# EAGLE design BEL (EAGLE 5.11)
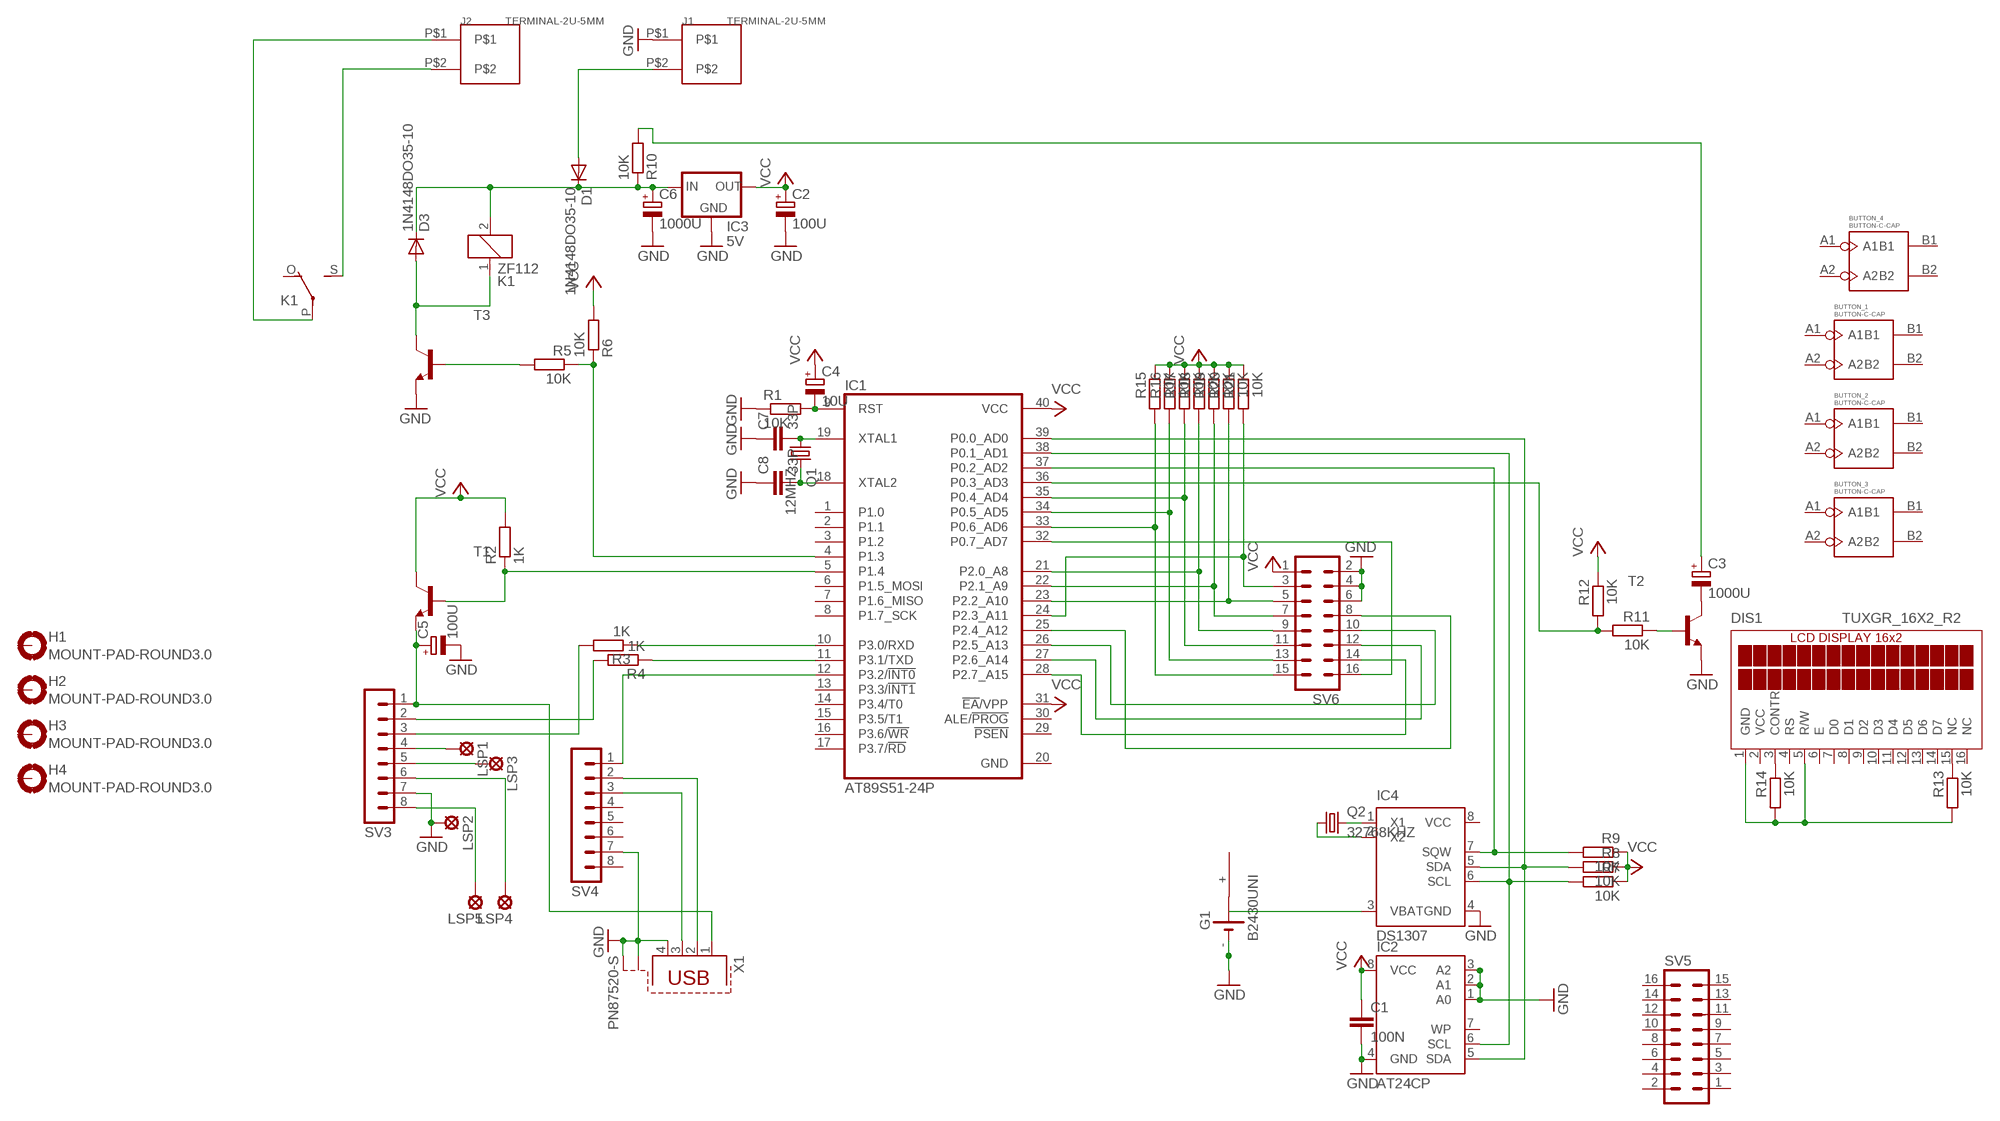
[diagram p0: schematic, sheet 1]

## Parts
BUTTON_1  BUTTON-C-CAP  [BUTTON_BIG_4PIN]
BUTTON_2  BUTTON-C-CAP  [BUTTON_BIG_4PIN]
BUTTON_3  BUTTON-C-CAP  [BUTTON_BIG_4PIN]
BUTTON_4  BUTTON-C-CAP  [BUTTON_BIG_4PIN]
C1  100N  C-EU075-032X103  [C075-032X103]
C2  100U  CPOL-EUE2.5-5  [E2,5-5]
C3  1000U  CPOL-EUE7.5-18  [E7,5-18]
C4  10U  CPOL-EUE2.5-5  [E2,5-5]
C5  100U  CPOL-EUE2.5-5  [E2,5-5]
C6  1000U  CPOL-EUE5-8.5  [E5-8,5]
C7  33P  C-EU025-025X050  [C025-025X050]
C8  33P  C-EU025-025X050  [C025-025X050]
D1  1N4148DO35-10  [DO35-10]
D3  1N4148DO35-10  [DO35-10]
DIS1  TUXGR_16X2_R2  [TUXGR_16X2_R2]
G1  B2430UNI  [B2430UNI]
H1  MOUNT-PAD-ROUND3.0  [3,0-PAD]
H2  MOUNT-PAD-ROUND3.0  [3,0-PAD]
H3  MOUNT-PAD-ROUND3.0  [3,0-PAD]
H4  MOUNT-PAD-ROUND3.0  [3,0-PAD]
IC1  AT89S51-24P  [DIL40]
IC2  AT24CP  [DIL08]
IC3  5V  78XXS  [78XXS]
IC4  DS1307  [DIP-8]
J1  TERMINAL-2U-5MM  [TERMINAL-2U-5MM]
J2  TERMINAL-2U-5MM  [TERMINAL-2U-5MM]
K1  ZF112  [ZF112]
LSP1  SE11  [SE11]
LSP2  SE11  [SE11]
LSP3  SE11  [SE11]
LSP4  SE11  [SE11]
LSP5  SE11  [SE11]
Q1  12MHZ  CRYSTALHC49S  [HC49/S]
Q2  32768KHZ  CRYSTALTC38H  [TC38H]
R1  10K  R-EU_0207/10  [0207/10]
R2  1K  R-EU_0207/10  [0207/10]
R3  1K  R-EU_0207/10  [0207/10]
R4  1K  R-EU_0207/10  [0207/10]
R5  10K  R-EU_0207/10  [0207/10]
R6  10K  R-EU_0207/10  [0207/10]
R7  10K  R-EU_0207/10  [0207/10]
R8  10K  R-EU_0207/10  [0207/10]
R9  10K  R-EU_0207/10  [0207/10]
R10  10K  R-EU_0207/10  [0207/10]
R11  10K  R-EU_0207/10  [0207/10]
R12  10K  R-EU_0207/10  [0207/10]
R13  10K  R-EU_0207/10  [0207/10]
R14  10K  R-EU_0207/10  [0207/10]
R15  10K  R-EU_0207/10  [0207/10]
R16  10K  R-EU_0207/10  [0207/10]
R17  10K  R-EU_0207/10  [0207/10]
R18  10K  R-EU_0207/10  [0207/10]
R19  10K  R-EU_0207/10  [0207/10]
R20  10K  R-EU_0207/10  [0207/10]
R21  10K  R-EU_0207/10  [0207/10]
SV3  MA08-1  [MA08-1]
SV4  MA08-1  [MA08-1]
SV5  ML16  [ML16]
SV6  ML16  [ML16]
T1  BC547-NPN-TO92-CBE  [TO92-CBE]
T2  BC547-NPN-TO92-CBE  [TO92-CBE]
T3  BC547-NPN-TO92-CBE  [TO92-CBE]
X1  PN87520-S  [PN87520-S]

## Nets
GND: C1.2 C2.- C5.- C6.- C7.1 C8.1 G1.- G1.-@1(-) IC2.1(A0) IC2.2(A1) IC2.3(A2) IC2.4(GND) IC3.GND IC4.4(GND) J1.P$1 LSP2.MP R1.1 SV3.7 SV4.7 SV6.2 SV6.4 SV6.6 T2.E T3.E X1.4 X1.S1 X1.S2
N$1: C8.2 IC1.18(XTAL2) Q1.2
N$2: C7.2 IC1.19(XTAL1) Q1.1
N$3: C4.- IC1.9(RST) R1.2
N$4: C3.+ R10.2
N$5: D3.A K1.1 T3.C
N$6: C5.+ SV3.1 T1.E X1.1
N$7: IC1.5(P1.4) R2.1 T1.B
N$8: IC4.2(X2) Q2.1
N$9: R4.2 SV3.2
N$10: R3.2 SV3.3
N$11: IC1.11(P3.1/TXD) R4.1
N$12: IC1.10(P3.0/RXD) R3.1
N$13: IC1.12(P3.2/!INT0) SV4.1
N$14: IC4.1(X1) Q2.2
N$15: IC1.38(P0.1_AD1) IC2.6(SCL) IC4.6(SCL) R7.2
N$16: SV4.2 X1.2
N$17: SV4.3 X1.3
N$18: LSP4.MP SV3.6
N$19: G1.+@4(+) IC4.3(VBAT)
N$20: R5.2 T3.B
N$21: IC1.4(P1.3) R5.1 R6.1
N$22: D1.A J1.P$2
N$23: J2.P$2 K1.S(2:S)
N$24: J2.P$1 K1.P(2:P)
N$25: IC1.37(P0.2_AD2) IC4.7(SQW) R9.2
N$27: C3.- T2.C
N$28: IC1.39(P0.0_AD0) IC2.5(SDA) IC4.5(SDA) R8.2
N$29: R11.1 T2.B
N$30: C6.+ D1.C D3.C IC3.IN K1.2 R10.1
N$31: IC1.36(P0.3_AD3) R11.2 R12.2
N$32: LSP5.MP SV3.8
N$33: LSP1.MP SV3.4
N$34: LSP3.MP SV3.5
N$35: DIS1.15(NC) R13.1
N$36: DIS1.3(CONTR) R14.1
N$37: DIS1.1(GND) DIS1.5(R/W) R13.2 R14.2
N$38: IC1.24(P2.3_A11) R21.2 SV6.3
N$39: IC1.23(P2.2_A10) R20.2 SV6.5
N$40: IC1.22(P2.1_A9) R19.2 SV6.7
N$41: IC1.21(P2.0_A8) R18.2 SV6.9
N$42: IC1.35(P0.4_AD4) R17.2 SV6.11
N$43: IC1.34(P0.5_AD5) R16.2 SV6.13
N$44: IC1.33(P0.6_AD6) R15.2 SV6.15
N$45: IC1.32(P0.7_AD7) SV6.16
N$46: IC1.28(P2.7_A15) SV6.14
N$47: IC1.27(P2.6_A14) SV6.12
N$48: IC1.26(P2.5_A13) SV6.10
N$49: IC1.25(P2.4_A12) SV6.8
VCC: C1.1 C2.+ C4.+ IC1.31(!EA!/VPP) IC1.40(VCC) IC2.8(VCC) IC3.OUT R2.2 R6.2 R7.1 R8.1 R9.1 R12.1 R15.1 R16.1 R17.1 R18.1 R19.1 R20.1 R21.1 SV6.1 T1.C
Unconnected: BUTTON_1.A1 BUTTON_1.A2 BUTTON_1.B1 BUTTON_1.B2 BUTTON_2.A1 BUTTON_2.A2 BUTTON_2.B1 BUTTON_2.B2 BUTTON_3.A1 BUTTON_3.A2 BUTTON_3.B1 BUTTON_3.B2 BUTTON_4.A1 BUTTON_4.A2 BUTTON_4.B1 BUTTON_4.B2 DIS1.4(RS) DIS1.6(E) DIS1.7(D0) DIS1.8(D1) DIS1.9(D2) DIS1.10(D3) DIS1.11(D4) DIS1.12(D5) DIS1.13(D6) DIS1.14(D7) DIS1.16(NC) G1.+ G1.+@1(+) G1.+@2(+) G1.+@3(+) H1.B3,0(MOUNT) H2.B3,0(MOUNT) H3.B3,0(MOUNT) H4.B3,0(MOUNT) IC1.1(P1.0) IC1.2(P1.1) IC1.3(P1.2) IC1.6(P1.5_MOSI) IC1.7(P1.6_MISO) IC1.8(P1.7_SCK) IC1.13(P3.3/!INT1) IC1.14(P3.4/T0) IC1.15(P3.5/T1) IC1.16(P3.6/!WR) IC1.17(P3.7/!RD) IC1.29(!PSEN) IC1.30(ALE/!PROG) IC2.7(WP) K1.O(2:O) SV4.4 SV4.5 SV4.6 SV4.8 SV5.1 SV5.2 SV5.3 SV5.4 SV5.5 SV5.6 SV5.7 SV5.8 SV5.9 SV5.10 SV5.11 SV5.12 SV5.13 SV5.14 SV5.15 SV5.16

## Power pins joined to a net without a drawn wire
GND: IC1.20(GND)
VCC: DIS1.2(VCC) IC4.8(VCC)

## Library data of the parts
BUTTON_1-BUTTON_4 = Itead_BP_110825.lbr:BUTTON-C-CAP: BAS004
C1 C7 C8 = resistor:C-EU: CAPACITOR, European symbol
C2-C6 = resistor:CPOL-EU: POLARIZED CAPACITOR, European symbol
D1 D3 = diode:1N4148: DIODE high speed (Philips)
DIS1 = display-lcd:TUXGR_16X2_R2: Tuxgraphics LCD display 16x2 characters reflective, without background light Source: tuxgr_12x2_r2.pdf; OC_FARNELL: unknown; OC_NEWARK: unknown
G1 = battery:B2430UNI: LI BATTERY
H1-H4 = holes:MOUNT-PAD-ROUND: MOUNTING PAD, round
IC1 = atmel:AT89S51-*: 8-bit Microcontroller with 4K BytesIn-System Programmable Flash Source: http://www.atmel.com/dyn/resources/prod_documents/doc2487.pdf; MPN: AT89S51-24PU; OC_FARNELL: 1095739; OC_NEWARK: 96K6578
IC2 = atmel:AT24C*: 2-wire serial EEPROM; MPN: AT24C1024BW-SH-B; OC_FARNELL: 1362646; OC_NEWARK: 03P2044
IC3 = v-reg:78XXS: VOLTAGE REGULATOR
IC4 = DS1307:DS1307: DS1307 - 64×8, Serial, I2C Real Time Clock
J1 J2 = Itead_BP_110825.lbr:TERMINAL-2U-5MM: CON001
K1 = relay:ZF112: RELAY 1 x switch; OC_FARNELL: unknown; OC_NEWARK: unknown
LSP1-LSP5 = solpad:SE11: SOLDER PAD RTM, drill 1,1mm, distributor Buerklin, 07F810
Q1 = crystal:CRYSTAL: CRYSTAL; OC_FARNELL: 1667008; OC_NEWARK: unknown
Q2 = crystal:CRYSTAL: CRYSTAL; OC_FARNELL: unknown; OC_NEWARK: unknown
R1-R21 = resistor:R-EU_: RESISTOR, European symbol
SV3 SV4 = con-lstb:MA08-1: PIN HEADER; OC_FARNELL: unknown; OC_NEWARK: unknown
SV5 SV6 = con-harting-ml:ML16: HARTING; OC_FARNELL: unknown; OC_NEWARK: unknown
T1-T3 = transistor:*-NPN-: NPN Transistror BF959 corrected 2008.03.06
X1 = con-berg:PN87520-S; OC_FARNELL: unknown; OC_NEWARK: unknown

## Board
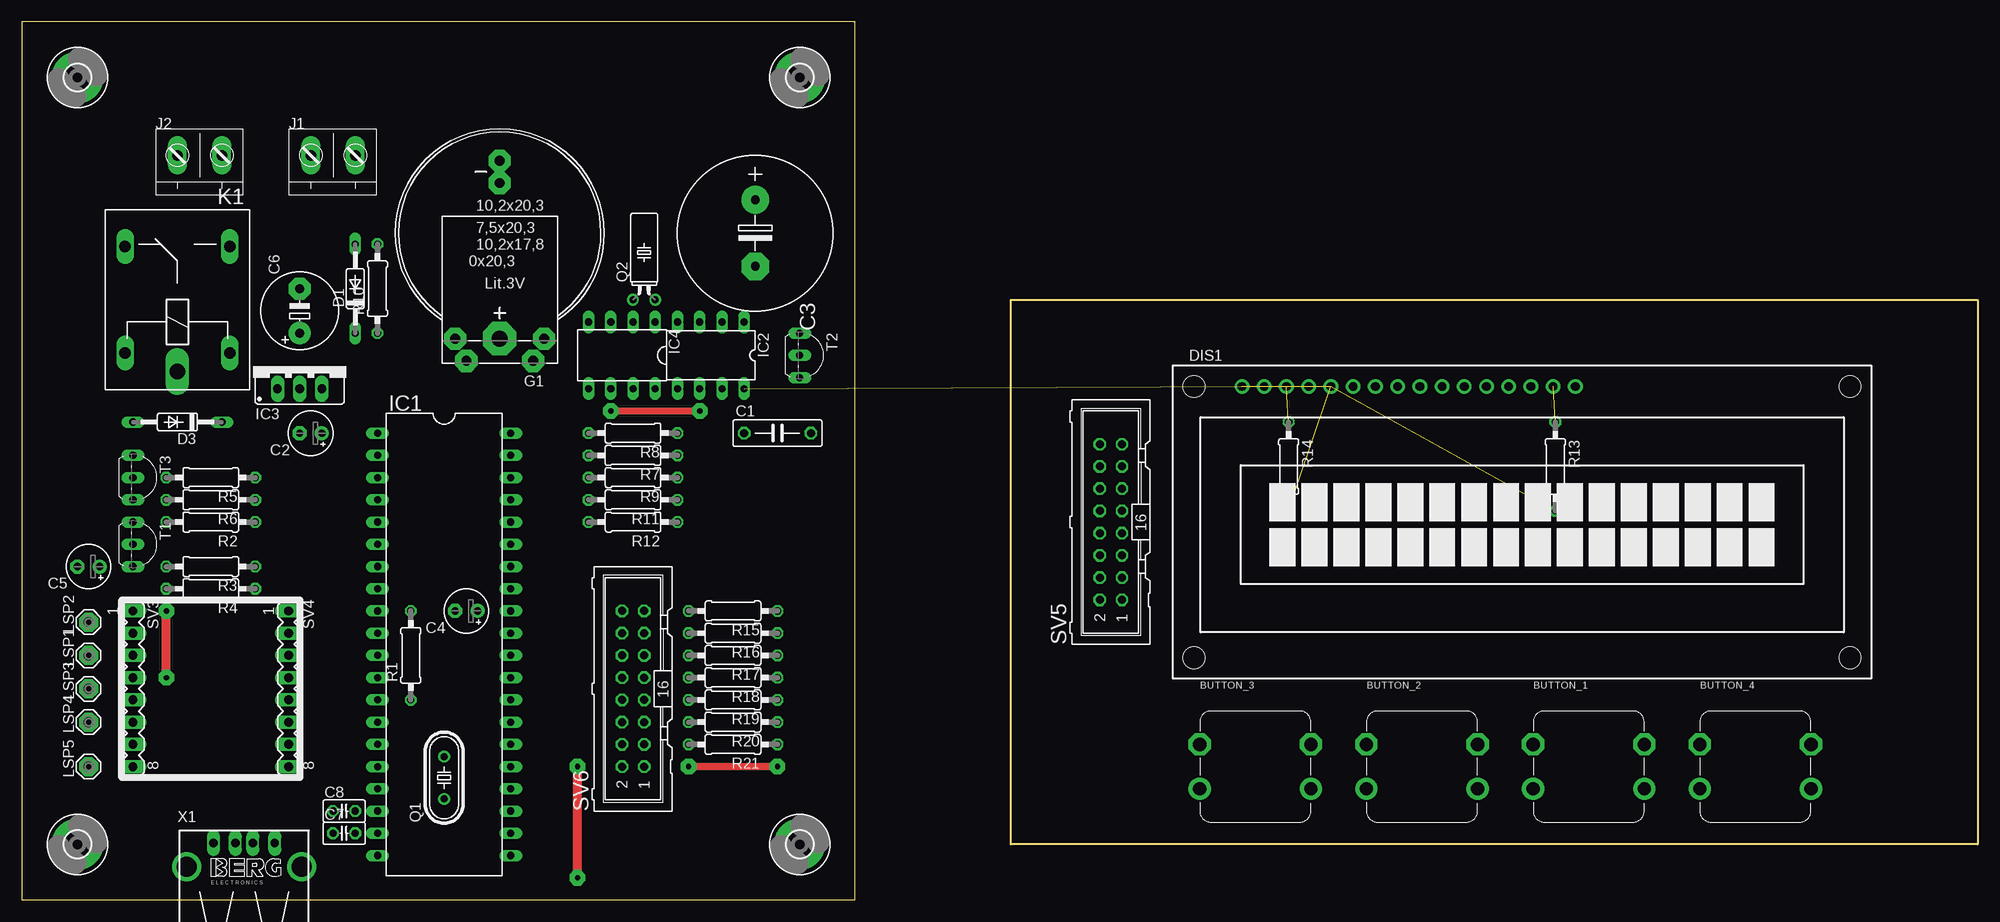
[diagram p1: board, top side]
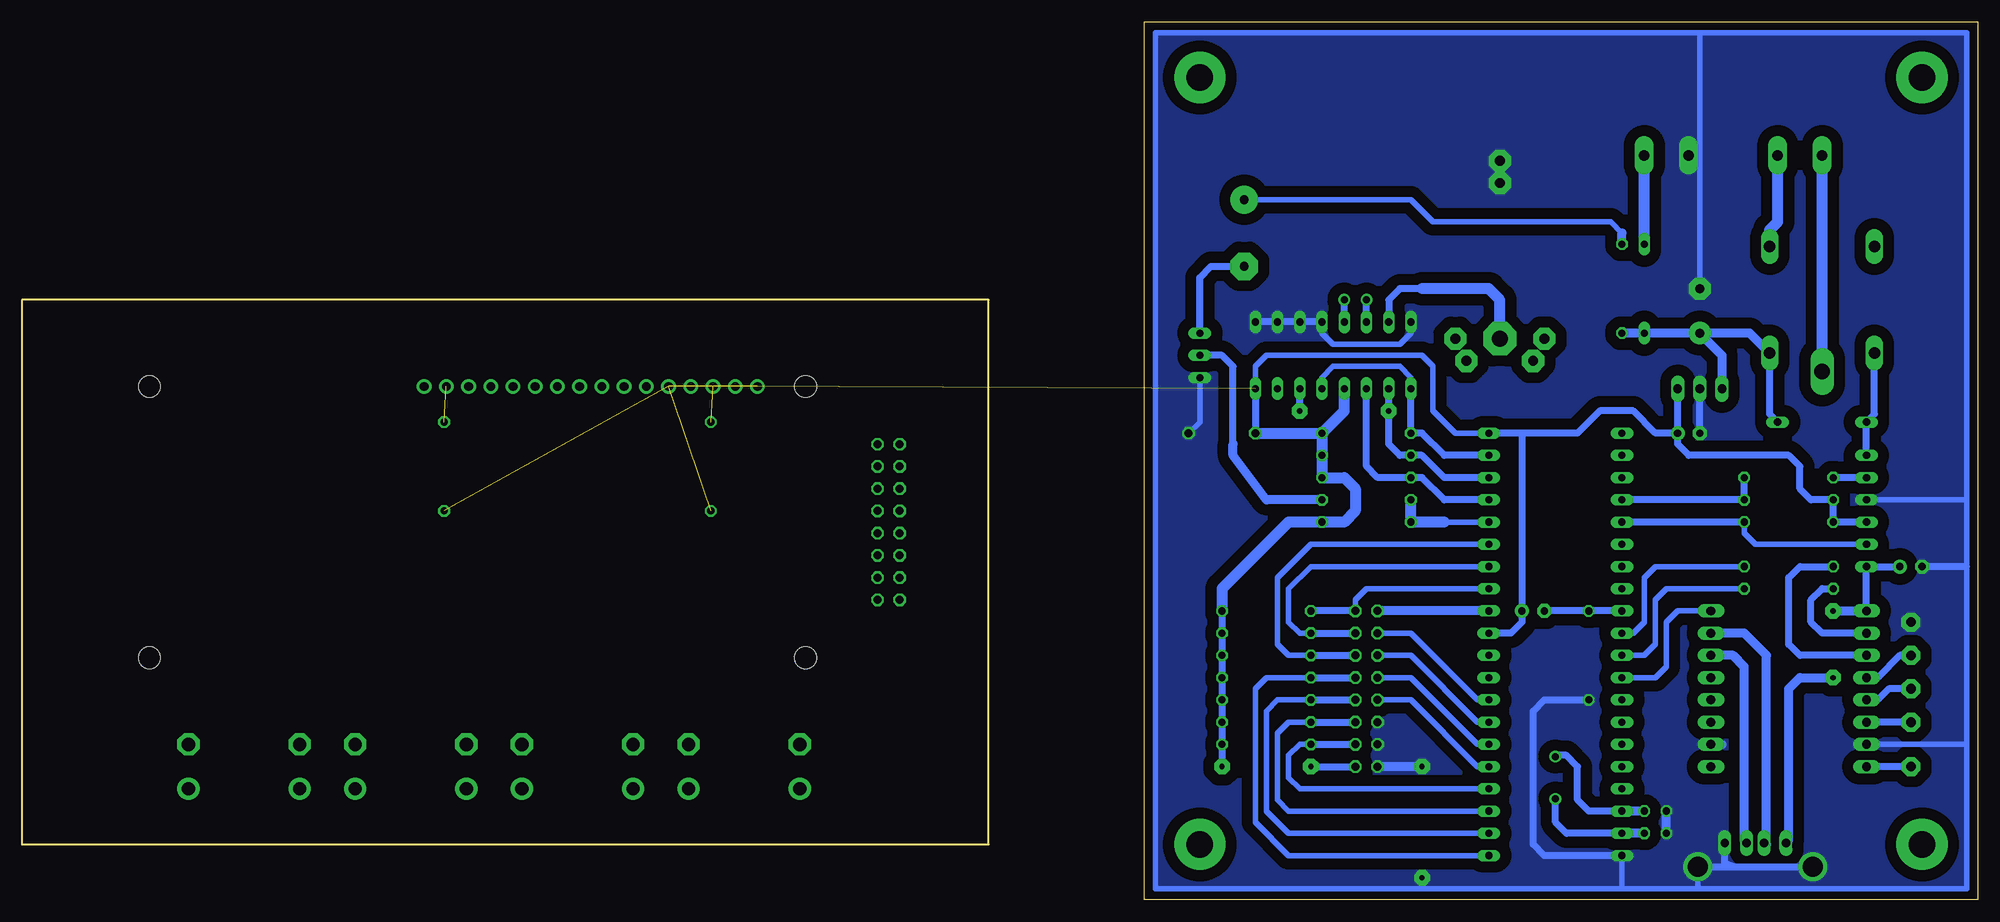
[diagram p2: board, bottom side, seen from below]

Size 223.52 x 100.33 mm. Coordinates in mm from the lower left corner, seen from the top.
Outline: 0,0 95.23,0 95.23,100.33 0,100.33 0,0
Outline: 113.03,6.35 113.03,68.58 223.52,68.58 223.52,6.35 113.03,6.35
Copper layers (1*16): Top 0.035mm / dielectric 1.5mm / Bottom 0.035mm
Design rules "default": minimum track width 10mil, minimum drill 24mil, track to track 8mil, track to pad 8mil, pad to pad 8mil, via to via 8mil, smd to smd 8mil, copper to edge 40mil, drill to drill 8mil, minimum pad ring 10mil, minimum via ring 8mil, stop-mask expansion 4mil, vias tented up to drill 0mil, thermal gap 10mil

### Footprints (pad centres in the part's own frame; a part is rotated, then mirrored left to right if it is on the bottom)
BUTTON_BIG_4PIN = drill 1.524 pad 2.54 octagon: A1 0,0; A2 12.7,0 | drill 1.524 pad 2.54 round: B1 0,-5.08; B2 12.7,-5.08
C075-032X103 = drill 0.914 octagon: 1 -3.81,0; 2 3.81,0
E2,5-5 = drill 0.813 pad 1.6 round: + -1.27,0 | drill 0.813 pad 1.6 octagon: - 1.27,0
E7,5-18 = drill 1.016 pad 3.15 round: + -3.81,0 | drill 1.016 pad 3.15 octagon: - 3.81,0
E5-8,5 = drill 1.016 pad 2.54 round: + -2.54,0 | drill 1.016 pad 2.54 octagon: - 2.54,0
C025-025X050 = drill 0.813 octagon: 1 -1.27,0; 2 1.27,0
DO35-10 = drill 0.813 long: A 5.08,0; C -5.08,0
TUXGR_16X2_R2 = drill 1 pad 1.676 round: 1 -32,15.5; 2 -29.46,15.5; 3 -26.92,15.5; 4 -24.38,15.5; 5 -21.84,15.5; 6 -19.3,15.5; 7 -16.76,15.5; 8 -14.22,15.5; 9 -11.68,15.5; 10 -9.14,15.5; 11 -6.6,15.5; 12 -4.06,15.5; 13 -1.52,15.5; 14 1.02,15.5; 15 3.56,15.5; 16 6.1,15.5 | hole 2.5: -37.5,-15.5; 37.5,-15.5; -37.5,15.5; 37.5,15.5
B2430UNI = drill 1.118 pad 2.54 octagon: + 3.81,14.605; +@1 -3.81,14.605; +@2 -5.08,12.065; +@3 5.08,12.065; - 0,-5.715; -@1 0,-8.255 | drill 1.803 pad 3.81 octagon: +@4 0,12.065
3,0-PAD = drill 3 pad 5.842 round: B3,0 0,0
DIL40 = drill 0.813 long: 1 -24.13,-7.62; 2 -21.59,-7.62; 3 -19.05,-7.62; 4 -16.51,-7.62; 5 -13.97,-7.62; 6 -11.43,-7.62; 7 -8.89,-7.62; 8 -6.35,-7.62; 9 -3.81,-7.62; 10 -1.27,-7.62; 11 1.27,-7.62; 12 3.81,-7.62; 13 6.35,-7.62; 14 8.89,-7.62; 15 11.43,-7.62; 16 13.97,-7.62; 17 16.51,-7.62; 18 19.05,-7.62; 19 21.59,-7.62; 20 24.13,-7.62; 21 24.13,7.62; 22 21.59,7.62; 23 19.05,7.62; 24 16.51,7.62; 25 13.97,7.62; 26 11.43,7.62; 27 8.89,7.62; 28 6.35,7.62; 29 3.81,7.62; 30 1.27,7.62; 31 -1.27,7.62; 32 -3.81,7.62; 33 -6.35,7.62; 34 -8.89,7.62; 35 -11.43,7.62; 36 -13.97,7.62; 37 -16.51,7.62; 38 -19.05,7.62; 39 -21.59,7.62; 40 -24.13,7.62
DIL08 = drill 0.813 long: 1 -3.81,-3.81; 2 -1.27,-3.81; 3 1.27,-3.81; 4 3.81,-3.81; 5 3.81,3.81; 6 1.27,3.81; 7 -1.27,3.81; 8 -3.81,3.81
78XXS = drill 1.016 long: GND 0,-2.54; IN -2.54,-2.54; OUT 2.54,-2.54
DIP-8 = drill 0.813 long: 1 -3.81,-3.81; 2 -1.27,-3.81; 3 1.27,-3.81; 4 3.81,-3.81; 5 3.81,3.81; 6 1.27,3.81; 7 -1.27,3.81; 8 -3.81,3.81
TERMINAL-2U-5MM = drill 1.2 pad 2.184 long: P$1 2.54,5.08; P$2 7.62,5.08
ZF112 = drill 1.321 long: 1 -6.096,5.994; 2 -6.096,-5.994; O 6.096,5.994; S 6.096,-5.994 | drill 1.803 long: P -8.204,0
SE11 = drill 1.118 pad 2.159 octagon: MP 0,0
HC49/S = drill 0.813 round: 1 -2.413,0; 2 2.413,0
TC38H = drill 0.813 round: 1 -1.27,0; 2 1.27,0
0207/10 = drill 0.813 octagon: 1 -5.08,0; 2 5.08,0
MA08-1 = drill 1.016 long: 1 -8.89,0; 2 -6.35,0; 3 -3.81,0; 4 -1.27,0; 5 1.27,0; 6 3.81,0; 7 6.35,0; 8 8.89,0
ML16 = drill 0.914 octagon: 1 -8.89,-1.27; 2 -8.89,1.27; 3 -6.35,-1.27; 4 -6.35,1.27; 5 -3.81,-1.27; 6 -3.81,1.27; 7 -1.27,-1.27; 8 -1.27,1.27; 9 1.27,-1.27; 10 1.27,1.27; 11 3.81,-1.27; 12 3.81,1.27; 13 6.35,-1.27; 14 6.35,1.27; 15 8.89,-1.27; 16 8.89,1.27
TO92-CBE = drill 0.813 long: B 0,0; C -2.54,0; E 2.54,0
PN87520-S = drill 0.95 long: 1 -3.5,2.71; 2 -1,2.71; 3 1,2.71; 4 3.5,2.71 | drill 2.3 pad 2.9 round: S1 -6.57,0; S2 6.57,0

### Placement (x,y rotation side)
BUTTON_1  172.72,17.78 0 top
BUTTON_2  153.67,17.78 0 top
BUTTON_3  134.62,17.78 0 top
BUTTON_4  191.77,17.78 0 top
C1  86.36,53.34 0 top
C2  33.02,53.34 180 top
C3  83.82,76.2 270 top
C4  50.8,33.02 180 top
C5  7.62,38.1 180 top
C6  31.75,67.31 90 top
C7  36.83,7.62 0 top
C8  36.83,10.16 0 top
D1  38.1,69.85 90 top
D3  17.78,54.61 180 top
DIS1  171.45,43.18 0 top
G1  54.61,76.2 180 top
H1  6.35,6.35 0 top
H2  88.9,6.35 0 top
H3  6.35,93.98 0 top
H4  88.9,93.98 0 top
IC1  48.26,29.21 270 top
IC2  78.74,62.23 180 top
IC3  31.75,60.96 0 top
IC4  68.58,62.23 180 top
J1  30.48,80.01 0 top
J2  15.24,80.01 0 top
K1  17.78,68.58 90 top
LSP1  7.62,27.94 90 top
LSP2  7.62,31.75 90 top
LSP3  7.62,24.13 90 top
LSP4  7.62,20.32 90 top
LSP5  7.62,15.24 90 top
Q1  48.26,13.97 90 top
Q2  71.12,68.58 0 top
R1  44.45,27.94 90 top
R2  21.59,43.18 180 top
R3  21.59,38.1 180 top
R4  21.59,35.56 180 top
R5  21.59,48.26 180 top
R6  21.59,45.72 180 top
R7  69.85,50.8 180 top
R8  69.85,53.34 180 top
R9  69.85,48.26 180 top
R10  40.64,69.85 90 top
R11  69.85,45.72 180 top
R12  69.85,43.18 180 top
R13  175.26,49.53 270 top
R14  144.78,49.53 270 top
R15  81.28,33.02 180 top
R16  81.28,30.48 180 top
R17  81.28,27.94 180 top
R18  81.28,25.4 180 top
R19  81.28,22.86 180 top
R20  81.28,20.32 180 top
R21  81.28,17.78 180 top
SV3  12.7,24.13 270 top
SV4  30.48,24.13 270 top
SV5  124.46,43.18 90 top
SV6  69.85,24.13 90 top
T1  12.7,40.64 270 top
T2  88.9,62.23 270 top
T3  12.7,48.26 270 top
X1  25.4,3.81 0 top

### Tracks (layer width: path | path; a pad name or v marks a point on that pad's centre or on a via)
GND  (via drill 0.6 pad 1.78)
  Top 1.016: v63.5,2.54 v63.5,15.24
  Bottom 0.61: 40.64,1.27 IC1.20 | 40.64,1.27 63.5,1.27 | 63.5,1.27 93.98,1.27 93.98,99.06 31.75,99.06 | 31.75,99.06 1.27,99.06 1.27,45.72 | 1.27,17.78 1.27,1.27 31.75,1.27 | 1.27,17.78 1.27,38.1 1.27,45.72 | 31.75,1.27 40.64,1.27 | X1.S2 31.97,1.49 31.75,1.27 | 1.27,45.72 T3.E | 1.27,17.78 SV3.7 | 31.75,99.06 31.75,85.09 | 31.75,85.09 C6.- | 31.75,85.09 J1.P$1 | IC4.4 64.77,64.77 66.04,63.5 73.66,63.5 74.93,64.77 IC2.4 | 63.5,1.27 v63.5,2.54 | T2.E 88.9,54.61 C1.2
  Bottom 0.813: IC1.20 49.53,5.08 50.8,6.35 50.8,21.59 49.53,22.86 R1.1 | 27.94,3.81 X1.S1 | X1.S2 27.94,3.81 | X1.4 28.9,4.12 27.94,3.81 | IC2.1 IC2.2 IC2.3 IC2.4 | 1.27,38.1 C5.- | C2.- IC3.GND
  Bottom 1.016: 29.21,17.78 SV4.7 | C7.1 C8.1 | v63.5,15.24 SV6.2
  pour Bottom (isolate 1.27, no thermals): 0,0 -2.54,101.6 95.25,100.33 95.25,0
N$1
  Bottom 0.813: IC1.18 44.45,10.16 45.72,11.43 45.72,15.24 46.99,16.51 48.13,16.51 Q1.2
  Bottom 1.016: C8.2 IC1.18
N$2
  Bottom 0.813: IC1.19 46.99,7.62 48.26,8.89 Q1.1
  Bottom 1.016: C7.2 IC1.19
N$3
  Bottom 0.813: IC1.9 R1.2 C4.-
N$4
  Bottom 0.61: C3.+ 64.77,80.01 62.23,77.47 41.91,77.47 40.64,76.2
  Bottom 1.016: R10.2 40.64,76.2
N$5
  Bottom 0.813: T3.C D3.A 11.79,55.52 K1.1
N$6  (via drill 0.6 pad 1.78)
  Top 1.016: v16.51,25.4 v16.51,33.02
  Bottom 0.813: SV3.1 T1.E C5.+ | X1.1 21.9,6.04 21.59,6.35
  Bottom 1.016: v16.51,33.02 SV3.1 | v16.51,25.4 20.32,25.4 21.59,24.13 21.59,6.83 X1.1
N$7
  Bottom 0.61: T1.B 25.4,40.64 26.67,41.91 R2.1
  Bottom 0.813: R2.1 IC1.5
N$8
  Bottom 0.813: IC4.2 Q2.1
N$9
  Bottom 0.813: R4.2 17.78,35.56 19.05,34.29 19.05,31.75 17.78,30.48 SV3.2
N$10
  Bottom 0.813: R3.2 20.32,38.1 21.59,36.83 21.59,29.21 20.32,27.94 SV3.3
N$11
  Bottom 0.61: IC1.11 38.1,27.94 36.83,29.21 36.83,34.29 35.56,35.56 R4.1
N$12
  Bottom 0.61: IC1.10 39.37,30.48 38.1,31.75 38.1,36.83 36.83,38.1 R3.1
N$13
  Bottom 0.61: SV4.1 34.29,33.02 35.56,31.75 35.56,26.67 36.83,25.4 IC1.12
N$14
  Bottom 0.813: IC4.1 Q2.2
N$15  (via drill 0.6 pad 1.78)
  Top 0.813: v67.31,55.88 v77.47,55.88
  Bottom 0.813: v77.47,55.88 IC2.6 | IC4.6 v67.31,55.88 67.31,52.07 66.04,50.8 R7.2 63.5,50.8 60.96,48.26 IC1.38
N$16
  Bottom 1.016: X1.2 24.4,6.62 24.13,6.35 24.13,27.94 26.67,30.48 SV4.2
N$17
  Bottom 1.016: SV4.3 27.94,27.94 26.67,26.67 26.67,6.79 X1.3
N$18
  Bottom 0.813: LSP4.MP SV3.6
N$19
  Bottom 0.813: 63.5,69.85 66.04,69.85 67.31,68.58 IC4.3
  Bottom 1.27: G1.+@4 54.61,68.58 55.88,69.85 63.5,69.85
N$20
  Bottom 0.813: T3.B R5.2
N$21
  Bottom 0.813: R5.1 R6.1 IC1.4
N$22
  Bottom 1.27: D1.A J1.P$2
N$23
  Bottom 1.27: K1.S 23.77,76.56 22.86,77.47 J2.P$2
N$24
  Bottom 1.27: K1.P J2.P$1
N$25
  Bottom 0.813: IC4.7 69.85,49.53 68.58,48.26 R9.2 63.5,48.26 60.96,45.72 IC1.37
N$27
  Bottom 0.813: C3.- 87.63,72.39 88.9,71.12 T2.C
N$28
  Bottom 0.61: IC4.5 64.77,59.69 66.04,60.96 73.66,60.96 74.93,59.69 IC2.5
  Bottom 0.813: IC4.5 R8.2 63.5,53.34 60.96,50.8 IC1.39
N$29
  Bottom 0.813: 85.09,52.07 85.09,60.96 86.36,62.23 T2.B
  Bottom 1.016: R11.1 81.28,45.72 85.09,50.8 85.09,52.07
N$30
  Bottom 0.813: K1.2 23.77,55.52 D3.C
  Bottom 1.016: C6.+ D1.C R10.1 | C6.+ 26.06,64.77 K1.2 | IC3.IN 29.21,62.23 C6.+
N$31
  Bottom 0.61: IC1.36 60.96,43.18
  Bottom 1.27: R11.2 R12.2 60.96,43.18
N$32
  Bottom 0.813: LSP5.MP SV3.8
N$33
  Bottom 0.813: SV3.4 11.43,25.4 8.89,27.94 LSP1.MP
N$34
  Bottom 0.813: SV3.5 11.43,22.86 10.16,24.13 LSP3.MP
N$35  (1 unrouted)
N$36  (1 unrouted)
N$37  (3 unrouted)
N$38
  Bottom 0.61: IC1.24 77.47,12.7 78.74,13.97 78.74,16.51 77.47,17.78 R21.2
  Bottom 0.813: R21.2 SV6.3
N$39
  Bottom 0.61: IC1.23 78.74,10.16 80.01,11.43 80.01,19.05 78.74,20.32 R20.2
  Bottom 0.813: R20.2 SV6.5
N$40
  Bottom 0.61: IC1.22 78.74,7.62 81.28,10.16 81.28,21.59 80.01,22.86 R19.2
  Bottom 0.813: R19.2 SV6.7
N$41
  Bottom 0.61: IC1.21 78.74,5.08 82.55,8.89 82.55,24.13 81.28,25.4 R18.2
  Bottom 0.813: R18.2 SV6.9
N$42
  Bottom 0.61: R17.2 78.74,27.94 80.01,29.21 80.01,36.83 76.2,40.64 IC1.35
  Bottom 0.813: R17.2 SV6.11
N$43
  Bottom 0.61: R16.2 77.47,30.48 78.74,31.75 78.74,35.56 76.2,38.1 IC1.34
  Bottom 0.813: R16.2 SV6.13
N$44
  Bottom 0.61: SV6.15 71.12,34.29 69.85,35.56 IC1.33
  Bottom 0.813: SV6.15 R15.2
N$45
  Bottom 1.016: IC1.32 SV6.16
N$46
  Bottom 0.61: IC1.28 57.15,22.86 64.77,30.48 SV6.14
N$47
  Bottom 0.61: IC1.27 57.15,20.32 64.77,27.94 SV6.12
N$48
  Bottom 0.61: IC1.26 57.15,17.78 64.77,25.4 SV6.10
N$49
  Bottom 0.61: IC1.25 57.15,15.24 64.77,22.86 SV6.8
VCC  (via drill 0.6 pad 1.78)  (1 unrouted)
  Top 0.813: v86.36,15.24 v76.2,15.24
  Bottom 0.61: IC1.40 59.69,53.34 62.23,55.88 62.23,60.96 63.5,62.23 81.28,62.23 82.55,60.96 IC2.8
  Bottom 0.813: IC1.31 53.34,30.48 52.07,31.75 C4.+ 52.07,53.34 | 52.07,53.34 IC1.40 | T1.C R2.2 R6.2 19.05,45.72 20.32,46.99 20.32,49.53 21.59,50.8 33.02,50.8 34.29,52.07 C2.+ | C2.+ IC3.OUT | 52.07,53.34 45.72,53.34 43.18,55.88 39.37,55.88 36.83,53.34 C2.+ | IC2.8 C1.1 | v76.2,15.24 SV6.1 | v86.36,15.24 R21.1 R20.1 R19.1 R18.1 R17.1 R16.1 R15.1
  Bottom 1.27: R8.1 R7.1 R9.1 72.39,48.26 71.12,46.99 71.12,44.45 72.39,43.18 R12.1 78.74,43.18 86.36,35.56 R15.1 | C1.1 R8.1 | IC4.8 72.39,55.88 R8.1